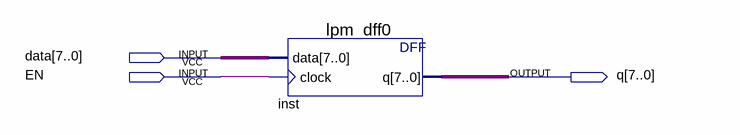
[diagram p0: schematic sheet]
// Quartus schematic test.bdf as structural Verilog: 1 symbols, 3 pins
module test (
  input  [7:0] data,
  input  EN,
  output [7:0] q
);

  lpm_dff0 inst (.data(data), .clock(EN), .q(q));
endmodule
